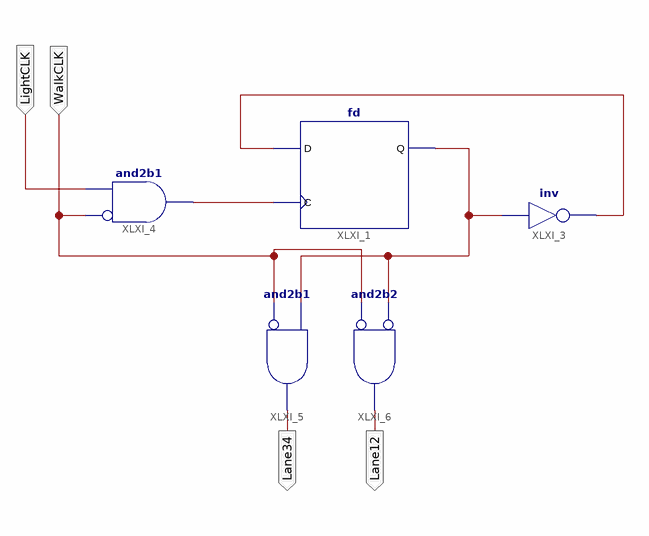
[diagram p0: schematic sheet 1]
// Xilinx ISE schematic TrafficLightSch.sch (spartan3e) as structural Verilog: 5 symbols, 4 ports
module TrafficLightSch (
  input  LightCLK,
  input  WalkCLK,
  output Lane34,
  output Lane12
);

  wire XLXN_1, XLXN_2, XLXN_3;

  fd XLXI_1 (.C(XLXN_1), .D(XLXN_3), .Q(XLXN_2));
  not XLXI_3 (XLXN_3, XLXN_2);
  and XLXI_4 (XLXN_1, ~WalkCLK, LightCLK);  // and2b1
  and XLXI_5 (Lane34, ~WalkCLK, XLXN_2);  // and2b1
  and XLXI_6 (Lane12, ~WalkCLK, ~XLXN_2);  // and2b2
endmodule
